# Altium schematic sheet DE-060718.SchDoc: MIFARE Door Reader
size A3; Author: eldar6776@hotmail.com; CompanyName: I-MEDIA Group d.o.o.; DrawnBy: Eldar Dedic; Organization: I-MEDIA Group d.o.o.; Address1: Topal Osman Paše 18; Address2: 71000 Sarajevo; Address3: Federacija BiH; Address4: Bosna i Hercegovina; DocumentNumber: DE-060718; Revision: 001; SheetNumber: 1; SheetTotal: 1; ProjectName: MIFARE DOOR READER
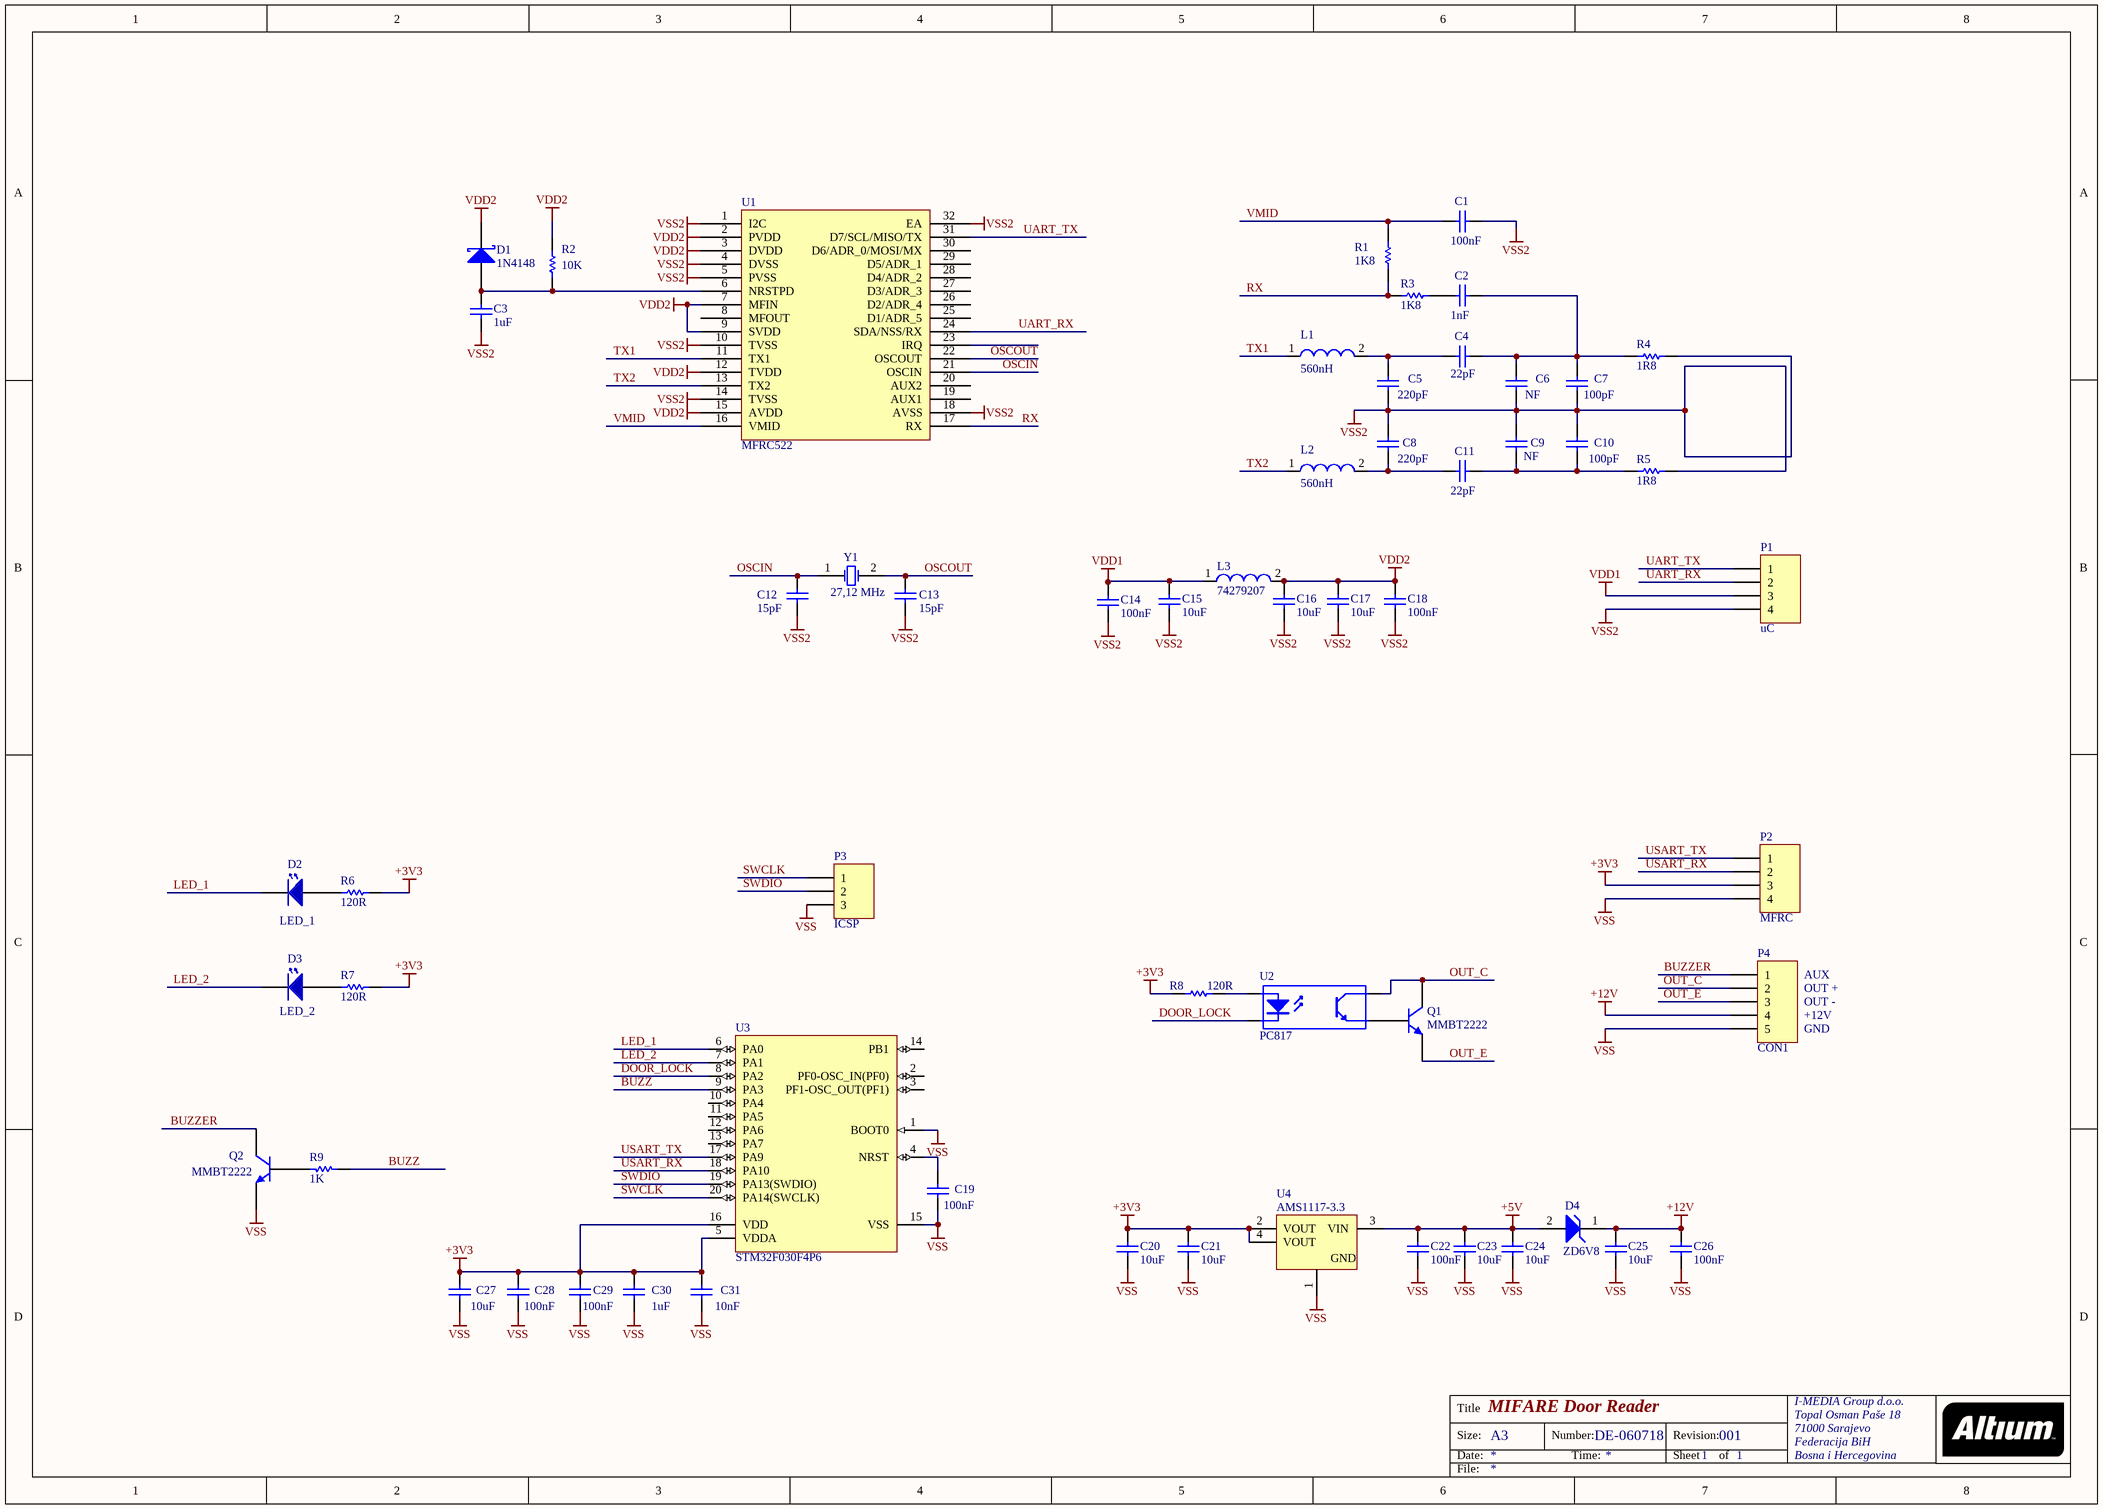
[diagram p0: DE-060718.SchDoc]

## Parts
C1  100nF  [0603]
C2  1nF  [0603]
C3  1uF  [0603]
C4  22pF  [0603]
C5  220pF  [0603]
C6  NF  [0603]
C7  100pF  [0603]
C8  220pF  [0603]
C9  NF  [0603]
C10  100pF  [0603]
C11  22pF  [0603]
C12  15pF  [0603]
C13  15pF  [0603]
C14  100nF  [0603]
C15  10uF  [0805]
C16  10uF  [0805]
C17  10uF  [0805]
C18  100nF  [0603]
C19  100nF  [0603]
C20  10uF  [0805]
C21  10uF  [0805]
C22  100nF  [0603]
C23  10uF  [0805]
C24  10uF  [0805]
C25  10uF  [0805]
C26  100nF  [0603]
C27  10uF  [0805]
C28  100nF  [0603]
C29  100nF  [0603]
C30  1uF  [0603]
C31  10nF  [0603]
D1  1N4148  [SOD323]
D2  LED_1  [LED 3mm]
D3  LED_2  [LED 3mm]
D4  ZD6V8  [ONSC-SOD-123-2-425-04_V]
L1  560nH  [SMD-0805]
L2  560nH  [SMD-0805]
L3  74279207  [SMD-0805]
P1  uC  [HDR1X4]
P2  MFRC  [HDR1X4]
P3  ICSP  [ICSP]
P4  CON1  [HDR1X5]
Q1  MMBT2222  [SOT23_N]
Q2  MMBT2222  [SOT23_N]
R1  1K8  [ERA-0603]
R2  10K  [ERA-0603]
R3  1K8  [ERA-0603]
R4  1R8  [ERA-0603]
R5  1R8  [ERA-0603]
R6  120R  [ERA-0603]
R7  120R  [ERA-0603]
R8  120R  [ERA-0603]
R9  1K  [ERA-0603]
U1  MFRC522  [QFN32]
U2  PC817  [SOP4]
U3  STM32F030F4P6  [STM-TSSOP20_N]
U4  AMS1117-3.3  [SOT-223_N]
Y1  27,12 MHz  [HC49/4H_SMX]

## Nets
+3V3: C20.2 C21.2 C27.2 C28.2 C29.2 C30.2 C31.2 P2.3 R6.1 R7.1 R8.2 U3.5(VDDA) U3.16(VDD) U4.2(VOUT) U4.4(VOUT)
+5V: C22.2 C23.2 C24.2 D4.2(A) U4.3(VIN)
+12V: C25.2 C26.2 D4.1(K) P4.4
VDD1: C14.2 C15.2 L3.1 P1.3
VDD2: C16.2 C17.2 C18.2 D1.1(K) L3.2 R2.2 U1.2(PVDD) U1.3(DVDD) U1.7(MFIN) U1.9(SVDD) U1.12(TVDD) U1.15(AVDD)
VSS: C19.1 C20.1 C21.1 C22.1 C23.1 C24.1 C25.1 C26.1 C27.1 C28.1 C29.1 C30.1 C31.1 P2.4 P3.3 P4.5 Q2.2(E) U3.1(BOOT0) U3.15(VSS) U4.1(GND)
VSS2: C1.1 C3.1 C5.1 C6.1 C7.1 C8.2 C9.2 C10.2 C12.1 C13.1 C14.1 C15.1 C16.1 C17.1 C18.1 P1.4 R4.1 R5.1 U1.1(I2C) U1.4(DVSS) U1.5(PVSS) U1.10(TVSS) U1.14(TVSS) U1.18(AVSS) U1.32(EA)
BUZZ: R9.2 U3.9(PA3)
BUZZER: P4.1 Q2.3(C)
DOOR_LOCK: U2.2(K) U3.8(PA2)
LED_1: D2.1 U3.6(PA0)
LED_2: D3.1 U3.7(PA1)
OSCIN: C12.2 U1.21(OSCIN) Y1.1(OSC1)
OSCOUT: C13.2 U1.22(OSCOUT) Y1.2(OSC2)
OUT_C: P4.2 Q1.3(C) U2.4(C)
OUT_E: P4.3 Q1.2(E)
RX: R1.2 R3.2 U1.17(RX)
SWCLK: P3.1 U3.20(PA14(SWCLK))
SWDIO: P3.2 U3.19(PA13(SWDIO))
TX1: L1.1 U1.11(TX1)
TX2: L2.1 U1.13(TX2)
UART_RX: P1.2 U1.24(SDA/NSS/RX)
UART_TX: P1.1 U1.31(D7/SCL/MISO/TX)
USART_RX: P2.2 U3.18(PA10)
USART_TX: P2.1 U3.17(PA9)
VMID: C1.2 R1.1 U1.16(VMID)
NetC2_1: C2.1 C4.1 C6.2 C7.2 R4.2
NetC2_2: C2.2 R3.1
NetC3_2: C3.2 D1.2(A) R2.1 U1.6(NRSTPD)
NetC4_2: C4.2 C5.2 L1.2
NetC8_1: C8.1 C11.2 L2.2
NetC9_1: C9.1 C10.1 C11.1 R5.2
NetC19_2: C19.2 U3.4(NRST)
NetD2_2: D2.2 R6.2
NetD3_2: D3.2 R7.2
NetQ1_1: Q1.1(B) U2.3(E)
NetQ2_1: Q2.1(B) R9.1
NetR8_1: R8.1 U2.1(A)

Not connected (* = marked no-connect by the designer): U1 8(MFOUT) 19(AUX1) 20(AUX2) 23(IRQ) 25(D1/ADR_5) 26(D2/ADR_4) 27(D3/ADR_3) 28(D4/ADR_2) 29(D5/ADR_1) 30(D6/ADR_0/MOSI/MX) 33; U3 2(PF0-OSC_IN(PF0)) 3(PF1-OSC_OUT(PF1)) 10(PA4) 11(PA5) 12(PA6) 13(PA7) 14(PB1)

## Notes on the sheet
- (near P4) OUT +
- (near P4) AUX
- (near P4) +12V
- (near P4) GND
- (near P4) OUT -
- Title
- Size:
- Date:
- A3
- Number:
- Time:
- Revision:
- Sheet
- of
- File:

## Library data of the parts
C1-C3 C12-C14 C18 C19 C22 C26 C28-C31 = C0603: Ceramic Chip Capacitor - Standard; Note: Footprint corresponds to dimensions for bulk cassette packaging. This case size has tightened tolerances.; Published: 17-Jul-2002; LatestRevisionDate: 19-Mar-2004; LatestRevisionNote: Silkscreen size reduced.; DatasheetDocument: Mar-2001; PackageDocument: Mar-2001; PackageReference: 0603; Publisher: Altium Limited; Code_JEITA: 0603; Code_IPC: 1608 [0603]; ComponentLink1Description: Manufacturer Link; ComponentLink1URL: http://www.kemet.com/; ComponentLink2Description: Datasheet; ComponentLink2URL: http://www.kemet.com/kemet/web/homepage/kechome.nsf/vapubfilesname/F3102TA.pdf/$file/F3102TA.pdf
  C1 C14 C18 C19 C22 C26 C28 C29: Value: 100nF
  C2: Value: 1nF
  C12 C13: Value: 15pF
  C30: Value: 1uF
  C31: Value: 10nF
C4 C11 = C0603: Ceramic Chip Capacitor - Standard; Note: Footprint corresponds to dimensions for bulk cassette packaging. This case size has tightened tolerances.; Value: 15pF; Published: 17-Jul-2002; LatestRevisionDate: 19-Mar-2004; LatestRevisionNote: Silkscreen size reduced.; DatasheetDocument: Mar-2001; PackageDocument: Mar-2001; PackageReference: 0603; Publisher: Altium Limited; Code_JEITA: 0603; Code_IPC: 1608 [0603]; ComponentLink1Description: Manufacturer Link; ComponentLink1URL: http://www.kemet.com/; ComponentLink2Description: Datasheet; ComponentLink2URL: http://www.kemet.com/kemet/web/homepage/kechome.nsf/vapubfilesname/F3102TA.pdf/$file/F3102TA.pdf
C5 C8 = C0603: Ceramic Chip Capacitor - Standard; Note: Footprint corresponds to dimensions for bulk cassette packaging. This case size has tightened tolerances.; Value: 47pF; Published: 17-Jul-2002; LatestRevisionDate: 19-Mar-2004; LatestRevisionNote: Silkscreen size reduced.; DatasheetDocument: Mar-2001; PackageDocument: Mar-2001; PackageReference: 0603; Publisher: Altium Limited; Code_JEITA: 0603; Code_IPC: 1608 [0603]; ComponentLink1Description: Manufacturer Link; ComponentLink1URL: http://www.kemet.com/; ComponentLink2Description: Datasheet; ComponentLink2URL: http://www.kemet.com/kemet/web/homepage/kechome.nsf/vapubfilesname/F3102TA.pdf/$file/F3102TA.pdf
C6 C9 = C0603: Ceramic Chip Capacitor - Standard; Note: Footprint corresponds to dimensions for bulk cassette packaging. This case size has tightened tolerances.; Value: 33pF; Published: 17-Jul-2002; LatestRevisionDate: 19-Mar-2004; LatestRevisionNote: Silkscreen size reduced.; DatasheetDocument: Mar-2001; PackageDocument: Mar-2001; PackageReference: 0603; Publisher: Altium Limited; Code_JEITA: 0603; Code_IPC: 1608 [0603]; ComponentLink1Description: Manufacturer Link; ComponentLink1URL: http://www.kemet.com/; ComponentLink2Description: Datasheet; ComponentLink2URL: http://www.kemet.com/kemet/web/homepage/kechome.nsf/vapubfilesname/F3102TA.pdf/$file/F3102TA.pdf
C7 C10 = C0603: Ceramic Chip Capacitor - Standard; Note: Footprint corresponds to dimensions for bulk cassette packaging. This case size has tightened tolerances.; Value: 10pF; Published: 17-Jul-2002; LatestRevisionDate: 19-Mar-2004; LatestRevisionNote: Silkscreen size reduced.; DatasheetDocument: Mar-2001; PackageDocument: Mar-2001; PackageReference: 0603; Publisher: Altium Limited; Code_JEITA: 0603; Code_IPC: 1608 [0603]; ComponentLink1Description: Manufacturer Link; ComponentLink1URL: http://www.kemet.com/; ComponentLink2Description: Datasheet; ComponentLink2URL: http://www.kemet.com/kemet/web/homepage/kechome.nsf/vapubfilesname/F3102TA.pdf/$file/F3102TA.pdf
C15-C17 C20 C21 C23-C25 C27 = C0805: Ceramic Chip Capacitor - Standard; Note: Footprint corresponds to dimensions for bulk cassette packaging. This case size has tightened tolerances.; Published: 17-Jul-2002; LatestRevisionDate: 19-Mar-2004; LatestRevisionNote: Silkscreen size reduced.; DatasheetDocument: Mar-2001; PackageDocument: Mar-2001; PackageReference: 0805; Publisher: Altium Limited; Code_JEITA: 0805; Code_IPC: 2012[0805]; ComponentLink1Description: Manufacturer Link; ComponentLink1URL: http://www.kemet.com/; ComponentLink2Description: Datasheet; ComponentLink2URL: http://www.kemet.com/kemet/web/homepage/kechome.nsf/vapubfilesname/F3102TA.pdf/$file/F3102TA.pdf; Value: 10uF
D1 = 1PS76SB10: Schottky Barrier Diode; Published: 17-Sep-2003; LatestRevisionDate: 19-Mar-2004; LatestRevisionNote: Silkscreen size reduced.; DatasheetVersion: 14-Oct-1996; PackageVersion: May-1999; PackageReference: SOD323; Publisher: Altium Limited; PackageDescription: SOD-323/SC-76; 2 Leads; Body 1.7 x 1.3 mm, (LxW); ComponentLink1Description: Manufacturer Link; ComponentLink1URL: http://www.semiconductors.philips.com/; ComponentLink2Description: Datasheet; ComponentLink2URL: http://www.semiconductors.philips.com/acrobat/datasheets/1PS76SB10_2.pdf
D2 D3 = LED 3mm
D4 = SZMMSZ6V8T1G: Zener Voltage Regulator, 500 mW, 2-Pin SOD-123, Pb-Free, Tape and Reel; Manufacturer: On Semiconductor; P Max (W): 0.5; DatasheetVersion: Rev. 11; PackageVersion: Rev. G, 10/2009; PackageReference: SOD-123-2-425-04; PackageDescription: 2-Pin SOD, Body 1.6 x 2.69 mm; Supplier 1: Digi-Key; Supplier Part Number 1: SZMMSZ6V8T1G-ND; Supplier 2: Mouser; Supplier Part Number 2: 863-SZMMSZ6V8T1G; Packing: Tape and Reel; RoHS: Pb-Free; Mounting Technology: Surface Mount; PartNumber: SZMMSZ6V8T1G; ComponentLink1Description: Manufacturer URL; ComponentLink1URL: http://www.onsemi.com/; ComponentLink2Description: Datasheet; ComponentLink2URL: http://www.onsemi.com/pub_link/Collateral/MMSZ2V4T1-D.PDF; ComponentLink3Description: Package Specification; ComponentLink3URL: http://www.onsemi.com/pub_link/Collateral/425-04.PDF
L1-L3 = 74279207: SMD EMI Suppression Ferrite Bead WE-CBF, Z = 100 Ohm; Impedance: 100 Ohm; DatasheetVersion: Dec-2005; PackageReference: SMD-0805; PackageDescription: Chip Inductor, 2-Leads, Body 2.0 x 1.2 mm; PartNumber: 74279207; ComponentLink1Description: Manufacturer URL; ComponentLink1URL: http://www.we-online.com; ComponentLink2Description: Datasheet; ComponentLink2URL: http://www.we-online.de/katalog/media/pdf/74279207.pdf
P1 P2 = Header 4: Header, 4-Pin; LatestRevisionDate: 17-Jul-2002; LatestRevisionNote: Re-released for DXP Platform.; Publisher: Altium Limited
P3 = ICSP: ICSP connection pads
P4 = Header 5: Header, 5-Pin; LatestRevisionDate: 17-Jul-2002; LatestRevisionNote: Re-released for DXP Platform.; Publisher: Altium Limited
Q1 Q2 = BC817: NPN General-purpose Transistor; Published: 17-Sep-2003; LatestRevisionDate: 12-Dec-2006; LatestRevisionNote: IPC-7351 Footprint Added.; DatasheetVersion: Jun-1999; PackageVersion: May-1999; PackageReference: SOT23; Publisher: Altium Limited; PackageDescription: 3-Pin SOT-23 Package 0.95 mm Pitch, 2.3 mm Lead Span; ComponentLink1Description: Manufacturer Link; ComponentLink1URL: http://www.semiconductors.philips.com/; ComponentLink2Description: Datasheet; ComponentLink2URL: http://www.semiconductors.philips.com/acrobat/datasheets/BC817_BC817W_BC337_5.pdf
R1-R9 = ERJ3RS: Low Ohmic Value Thick Film Chip Resistor, 0.1 Ohm to 0.2 Ohm Range, 1%, 2% and 5% Tolerance, 0603 Size, 0.1 W; Published: 17-Dec-2003; LatestRevisionDate: 19-Mar-2004; LatestRevisionNote: Silkscreen size reduced.; PackageDocument: Mar-2003; PackageReference: 3-0603; Publisher: Altium Limited; Code_IPC: 1608 [0603]; ComponentLink1Description: Manufacturer Link; ComponentLink1URL: http://www.panasonic.com/industrial/components/resistive_products.htm; ComponentLink2Description: Datasheet; ComponentLink2URL: http://www.panasonic.com/industrial/components/pdf/AOA0000CE3.pdf
U1 = MFRC522: MIFARE reader writer
U2 = PC817 optocoupler: 4-Pin Phototransistor Optocoupler; Published: 24-Mar-1999; LatestRevisionDate: 04-Mar-2005; LatestRevisionNote: Sch pins 3 & 4 Swapped.; DatasheetVersion: Nov-2003; PackageReference: DIP-4; Publisher: Altium Limited
U3 = STM32F030F4P6: ARM Cortex-M0 32-bit MCU, 16 KB Flash, 4 KB Internal RAM, 15 I/Os, 20-pin TSSOP, -40 to 85 degC, Tube; FLASH Size (Prog) (kB): 16; I/Os (High Current): 15; Internal RAM Size (kB): 4; Operating Frequency(F) (Processor speed) (MHz): 48; Supply Voltage(Vcc) min (V): 2.4; DatasheetVersion: Rev. 1; PackageVersion: Rev. 1, 11/2012; PackageReference: TSSOP20; PackageDescription: 20-Pin Thin Shrink Small Outline Package, 6.5 x 4.4 mm Body, 0.65 mm Pitch; Supplier 1: Digi-Key; Supplier Part Number 1: 497-14044-5-ND; Supplier 2: Newark; Supplier Part Number 2: 06X3648; Supplier 3: Mouser; Supplier Part Number 3: 511-STM32F030F4P6; Core: ARM Cortex-M0; Packing: Tube; Mounting Technology: Surface Mount; PartNumber: STM32F030F4P6; ComponentLink1Description: Manufacturer URL; ComponentLink1URL: http://www.st.com/web/en/home.html; ComponentLink2Description: Datasheet; ComponentLink2URL: http://www.st.com/st-web-ui/static/active/en/resource/technical/document/datasheet/DM00088500.pdf; ComponentLink3Description: Package Specification; ComponentLink3URL: http://www.st.com/st-web-ui/static/active/en/resource/technical/document/datasheet/DM00065136.pdf
U4 = LD1117AS33TR: 1A, Low Drop Positive Voltage Regulator, 3.3V, 4-Pin SOT-223, Tape and Reel; DatasheetVersion: Dec-2011; PackageVersion: 2010; PackageReference: SOT-223; PackageDescription: 4-Pin SOT-223 Package, 6.5 x 3.5 mm Body, 2.3 mm Pitch, 7 mm Lead Span; PartNumber: LD1117AS33TR; ComponentLink1Description: Manufacturer URL; ComponentLink1URL: http://www.st.com; ComponentLink2Description: Datasheet; ComponentLink2URL: http://www.st.com/internet/com/TECHNICAL_RESOURCES/TECHNICAL_LITERATURE/DATASHEET/CD00002116.pdf
Y1 = HC49/4H_SMX: Surface Mount Quartz Crystal; Note: PCB layout complies with manufacturer's recommendation.; Published: 17-Jul-2002; DatasheetDocument: 18-Oct-1999; PackageDocument: 18-Oct-1999; PackageReference: HC49/4H_SMX; Publisher: Altium Limited; ComponentLink1Description: Manufacturer Link; ComponentLink1URL: http://www.cmac.com/mt/; ComponentLink2Description: Datasheet; ComponentLink2URL: http://www.cmac.com/mt/databook/crystals/smd/hc49_4h_smx.pdf